# EAGLE schematic xambi_1.1 (EAGLE 6.5.0)
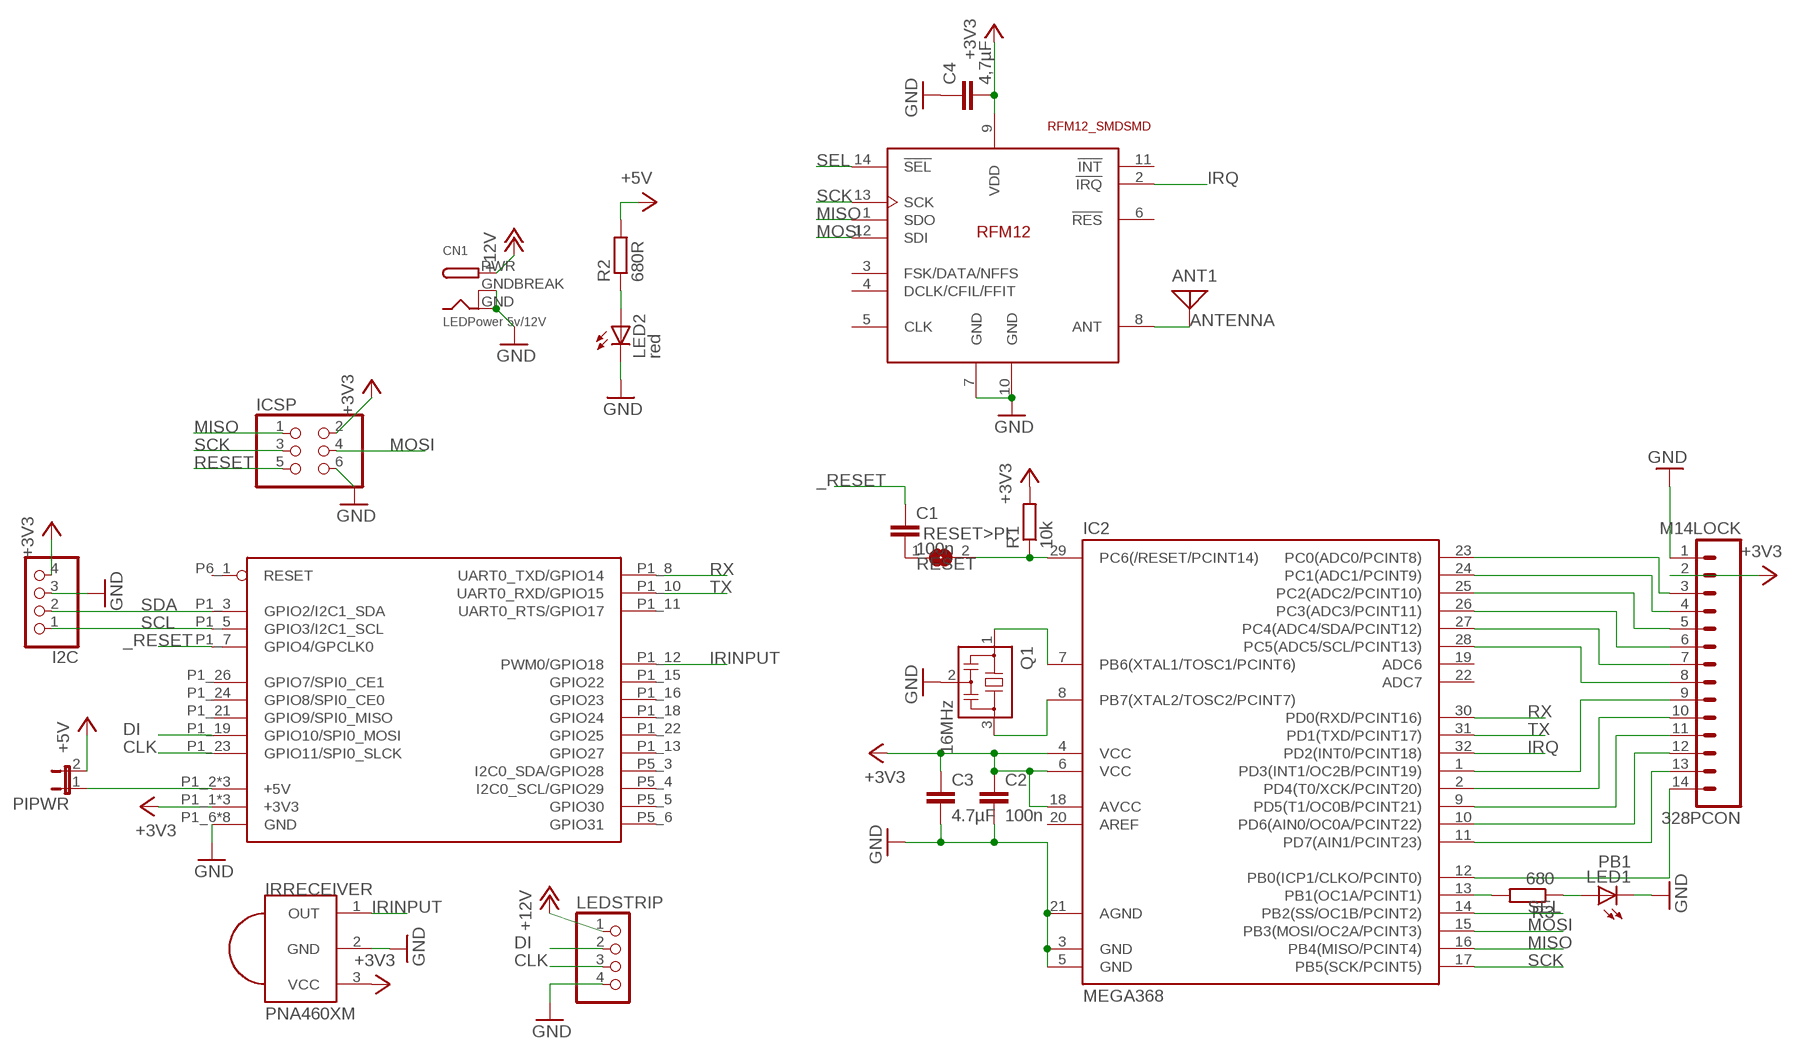
[diagram p0: schematic, sheet 1]

## Parts
328PCON  M14LOCK  [1X14_LOCK]
ANT1  ANTENNA  [PAD-01]
C1  100n  C-EUC1206  [C1206]
C2  100n  C-EUC1206  [C1206]
C3  4.7µF  C-EUC1206  [C1206]
C4  4,7µF  C-EUC1206  [C1206]
CN1  LEDPower 5v/12V  DCBARRELPTH  [DCJACK_2MM_PTH]
I2C  PINHD-1X4  [1X04]
IC2  MEGA368  MEGA48/88/168-AU  [TQFP32-08]
ICSP  PINHD-2X3  [2X03]
IRRECEIVER  PNA460XM  [PNA460XM]
LED1  PB1  LEDCHIPLED_0603  [CHIPLED_0603]
LED2  red  LEDCHIPLED_0603  [CHIPLED_0603]
LEDSTRIP  PINHD-1X4  [1X04]
PIPWR  JP1E  [JP1]
Q1  16MHz  CSTCR6M00G53Z  [CSTCR6M]
R1  10k  R-EU_R1206  [R1206]
R2  680R  R-EU_R0805  [R0805]
R3  680  R-EU_R0805  [R0805]
RESET>PI  SJ  [SJ]
U$1  RFM12_SMDSMD  [RFM12]
XAMBI_SHIELD_1.1  XPIX Development / 2014  RPI-B-V2NO_SHIELD  [RPI-B-V2]

## Nets
+3V3: 328PCON.2 C2.1 C3.1 C4.2 I2C.4 IC2.4(VCC) IC2.6(VCC) IC2.18(AVCC) ICSP.2 IRRECEIVER.3(VCC) R1.2 U$1.9(VDD) XAMBI_SHIELD_1.1.P1_1(+3V3) XAMBI_SHIELD_1.1.P1_17(+3V3) XAMBI_SHIELD_1.1.P5_2(+3V3)
+5V [power]: PIPWR.2 R2.2
+12V [power]: CN1.PWR LEDSTRIP.1
_RESET: C1.1 XAMBI_SHIELD_1.1.P1_7(GPIO4/GPCLK0)
ANTENNA: ANT1.1 U$1.8(ANT)
CLK: LEDSTRIP.3 XAMBI_SHIELD_1.1.P1_23(GPIO11/SPI0_SLCK)
DI: LEDSTRIP.2 XAMBI_SHIELD_1.1.P1_19(GPIO10/SPI0_MOSI)
GND [power]: 328PCON.1 C2.2 C3.2 C4.1 CN1.GND CN1.GNDBREAK I2C.3 IC2.3(GND) IC2.5(GND) IC2.21(AGND) ICSP.6 IRRECEIVER.2(GND) LED1.C LED2.C LEDSTRIP.4 Q1.2 U$1.7(GND) U$1.10(GND) XAMBI_SHIELD_1.1.P1_6(GND) XAMBI_SHIELD_1.1.P1_9(GND) XAMBI_SHIELD_1.1.P1_14(GND) XAMBI_SHIELD_1.1.P1_20(GND) XAMBI_SHIELD_1.1.P1_25(GND) XAMBI_SHIELD_1.1.P5_7(GND) XAMBI_SHIELD_1.1.P5_8(GND) XAMBI_SHIELD_1.1.P6_2(GND)
IRINPUT: IRRECEIVER.1(OUT) XAMBI_SHIELD_1.1.P1_12(PWM0/GPIO18)
IRQ: IC2.32(PD2(INT0/PCINT18)) U$1.2(!IRQ)
MISO: IC2.16(PB4(MISO/PCINT4)) ICSP.1 U$1.1(SDO)
MOSI: IC2.15(PB3(MOSI/OC2A/PCINT3)) ICSP.4 U$1.12(SDI)
N$1: C1.2 RESET>PI.1
N$2: IC2.7(PB6(XTAL1/TOSC1/PCINT6)) Q1.1
N$3 [power]: PIPWR.1 XAMBI_SHIELD_1.1.P1_2(+5V) XAMBI_SHIELD_1.1.P1_4(+5V) XAMBI_SHIELD_1.1.P5_1(+5V)
N$4: IC2.8(PB7(XTAL2/TOSC2/PCINT7)) Q1.3
N$7: LED2.A R2.1
N$19: LED1.A R3.1
N$20: IC2.13(PB1(OC1A/PCINT1)) R3.2
PB0: 328PCON.14 IC2.12(PB0(ICP1/CLKO/PCINT0))
PC0: 328PCON.3 IC2.23(PC0(ADC0/PCINT8))
PC1: 328PCON.4 IC2.24(PC1(ADC1/PCINT9))
PC2: 328PCON.5 IC2.25(PC2(ADC2/PCINT10))
PC3: 328PCON.6 IC2.26(PC3(ADC3/PCINT11))
PC4: 328PCON.7 IC2.27(PC4(ADC4/SDA/PCINT12))
PC5: 328PCON.8 IC2.28(PC5(ADC5/SCL/PCINT13))
PD3: 328PCON.9 IC2.1(PD3(INT1/OC2B/PCINT19))
PD4: 328PCON.10 IC2.2(PD4(T0/XCK/PCINT20))
PD5: 328PCON.11 IC2.9(PD5(T1/OC0B/PCINT21))
PD6: 328PCON.12 IC2.10(PD6(AIN0/OC0A/PCINT22))
PD7: 328PCON.13 IC2.11(PD7(AIN1/PCINT23))
RESET: IC2.29(PC6(/RESET/PCINT14)) ICSP.5 R1.1 RESET>PI.2
RX: IC2.30(PD0(RXD/PCINT16)) XAMBI_SHIELD_1.1.P1_8(UART0_TXD/GPIO14)
SCK: IC2.17(PB5(SCK/PCINT5)) ICSP.3 U$1.13(SCK)
SCL: I2C.1 XAMBI_SHIELD_1.1.P1_5(GPIO3/I2C1_SCL)
SDA: I2C.2 XAMBI_SHIELD_1.1.P1_3(GPIO2/I2C1_SDA)
SEL: IC2.14(PB2(SS/OC1B/PCINT2)) U$1.14(!SEL)
TX: IC2.31(PD1(TXD/PCINT17)) XAMBI_SHIELD_1.1.P1_10(UART0_RXD/GPIO15)
Unconnected: IC2.19(ADC6) IC2.20(AREF) IC2.22(ADC7) U$1.3(FSK/DATA/NFFS) U$1.4(DCLK/CFIL/FFIT) U$1.5(CLK) U$1.6(!RES) U$1.11(!INT) XAMBI_SHIELD_1.1.P1_11(UART0_RTS/GPIO17) XAMBI_SHIELD_1.1.P1_13(GPIO27) XAMBI_SHIELD_1.1.P1_15(GPIO22) XAMBI_SHIELD_1.1.P1_16(GPIO23) XAMBI_SHIELD_1.1.P1_18(GPIO24) XAMBI_SHIELD_1.1.P1_21(GPIO9/SPI0_MISO) XAMBI_SHIELD_1.1.P1_22(GPIO25) XAMBI_SHIELD_1.1.P1_24(GPIO8/SPI0_CE0) XAMBI_SHIELD_1.1.P1_26(GPIO7/SPI0_CE1)

## Power pins joined to a net without a drawn wire
GPIO30: XAMBI_SHIELD_1.1.P5_5(GPIO30)
GPIO31: XAMBI_SHIELD_1.1.P5_6(GPIO31)
I2C0_SCL/GPIO29: XAMBI_SHIELD_1.1.P5_4(I2C0_SCL/GPIO29)
I2C0_SDA/GPIO28: XAMBI_SHIELD_1.1.P5_3(I2C0_SDA/GPIO28)
RESET: XAMBI_SHIELD_1.1.P6_1(RESET)

## Library data of the parts
328PCON = SparkFun-Connectors:M14: Header 14 Standard 14-pin 0.1" header. Use with straight break away headers (SKU : PRT-00116), right angle break away headers (PRT-00553), swiss pins (PRT-00743), machine pins (PRT-00117), and female headers (PRT-00115).
ANT1 = discrete:ANTENNA: Antenna
C1-C4 = rcl:C-EU: CAPACITOR, European symbol
CN1 = _adafruit:DCBARREL: 2.0mm DC Barrel Jack DCJACK_2MM_PTH - Through Hole Jack (4UConnector: 05537)
I2C LEDSTRIP = pinhead:PINHD-1X4: PIN HEADER
IC2 = avr-7:MEGA48/88/168
ICSP = pinhead:PINHD-2X3: PIN HEADER
IRRECEIVER = _adafruit:PNA460XM: IR 38KHz receiver PNA4602 and related receivers http://www.ladyada.net/library/pcb/eaglelibrary.html
LED1 LED2 = _adafruit:LED: LED OSRAM: - CHIPLED LG R971, LG N971, LY N971, LG Q971, LY Q971, LO R971, LY R971 LH N974, LH R974 LS Q976, LO Q976, LY Q976 LO Q996 - Hyper CHIPLED LW Q18S LB Q993, LB Q99A, LB R99A - SideLED LS A670, LO A670, LY A670, LG A670, LP A670 LB A673, LV A673, LT A673, LW A673 LH A674 LY A675 LS A676, LA A676, LO A676, LY A676, LW A676 LS A679, LY A679, LG A679 - Hyper Micro SIDELED® LS Y876, LA Y876, LO Y876, LY Y876 LT Y87S - SmartLED LW L88C, LW L88S LB L89C, LB L89S, LG L890 LS L89K, LO L89K, LY L89K LS L896, LA L896, LO L896, LY L896 - TOPLED LS T670, LO T670, LY T670, LG T670, LP T670 LSG T670, LSP T670, LSY T670, LOP T670, LYG T670 LG T671, LOG T671, LSG T671 LB T673, LV T673, LT T673, LW T673 LH T674 LS T676, LA T676, LO T676, LY T676, LB T676, LH T676, LSB T676, LW T676 LB T67C, LV T67C, LT T67C, LS T67K, LO T67K, LY T67K, LW E67C LS E67B, LA E67B, LO E67B, LY E67B, LB E67C, LV E67C, LT E67C LW T67C LS T679, LY T679, LG T679 LS T770, LO T770, LY T770, LG T770, LP T770 LB T773, LV T773, LT T773, LW T773 LH T774 LS E675, LA E675, LY E675, LS T675 LS T776, LA T776, LO T776, LY T776, LB T776 LHGB T686 LT T68C, LB T68C - Hyper Mini TOPLED® LB M676 - Mini TOPLED Santana® LG M470 LS M47K, LO M47K, LY M47K Source: http://www.osram.convergy.de/
PIPWR = jumper:JP1E: JUMPER
Q1 = murata-filter:CSTCR: Resonator Source: murata.co.jp; MPN: CSTCR6M00G53-R0; OC_FARNELL: 1170434; OC_NEWARK: 25M8759
R1-R3 = rcl:R-EU_: RESISTOR, European symbol
RESET>PI = jumper:SJ: SMD solder JUMPER
U$1 = rfm_12:RFM12_SMD: RFM12 is a low costing ISM band transceiver module implemented with unique PLL. It works signal ranges from 315/433/868/915MHZ bands, comply with FCC, ETSI regulation. The SPI interface is used to communicate with microcontroller for parameter setting.
XAMBI_SHIELD_1.1 = raspberry:RPI-B-V2: Second revision of the Model 2 board including the P5 and P6 headers. Mounting holes have been added. Choose the "SHIELD" variant for a predefined Dimension layer and drilling holes. Theres also a "SHIELD" variant for the Model A without a RJ45 connector.

## Net classes
0 default: width 0.203 mm, drill 0.254 mm, clearance 0.152 mm
1 power: width 0.508 mm, drill 0.305 mm, clearance 0.203 mm